# EAGLE design WalkieTalkie_Basic (EAGLE 7.3.0)
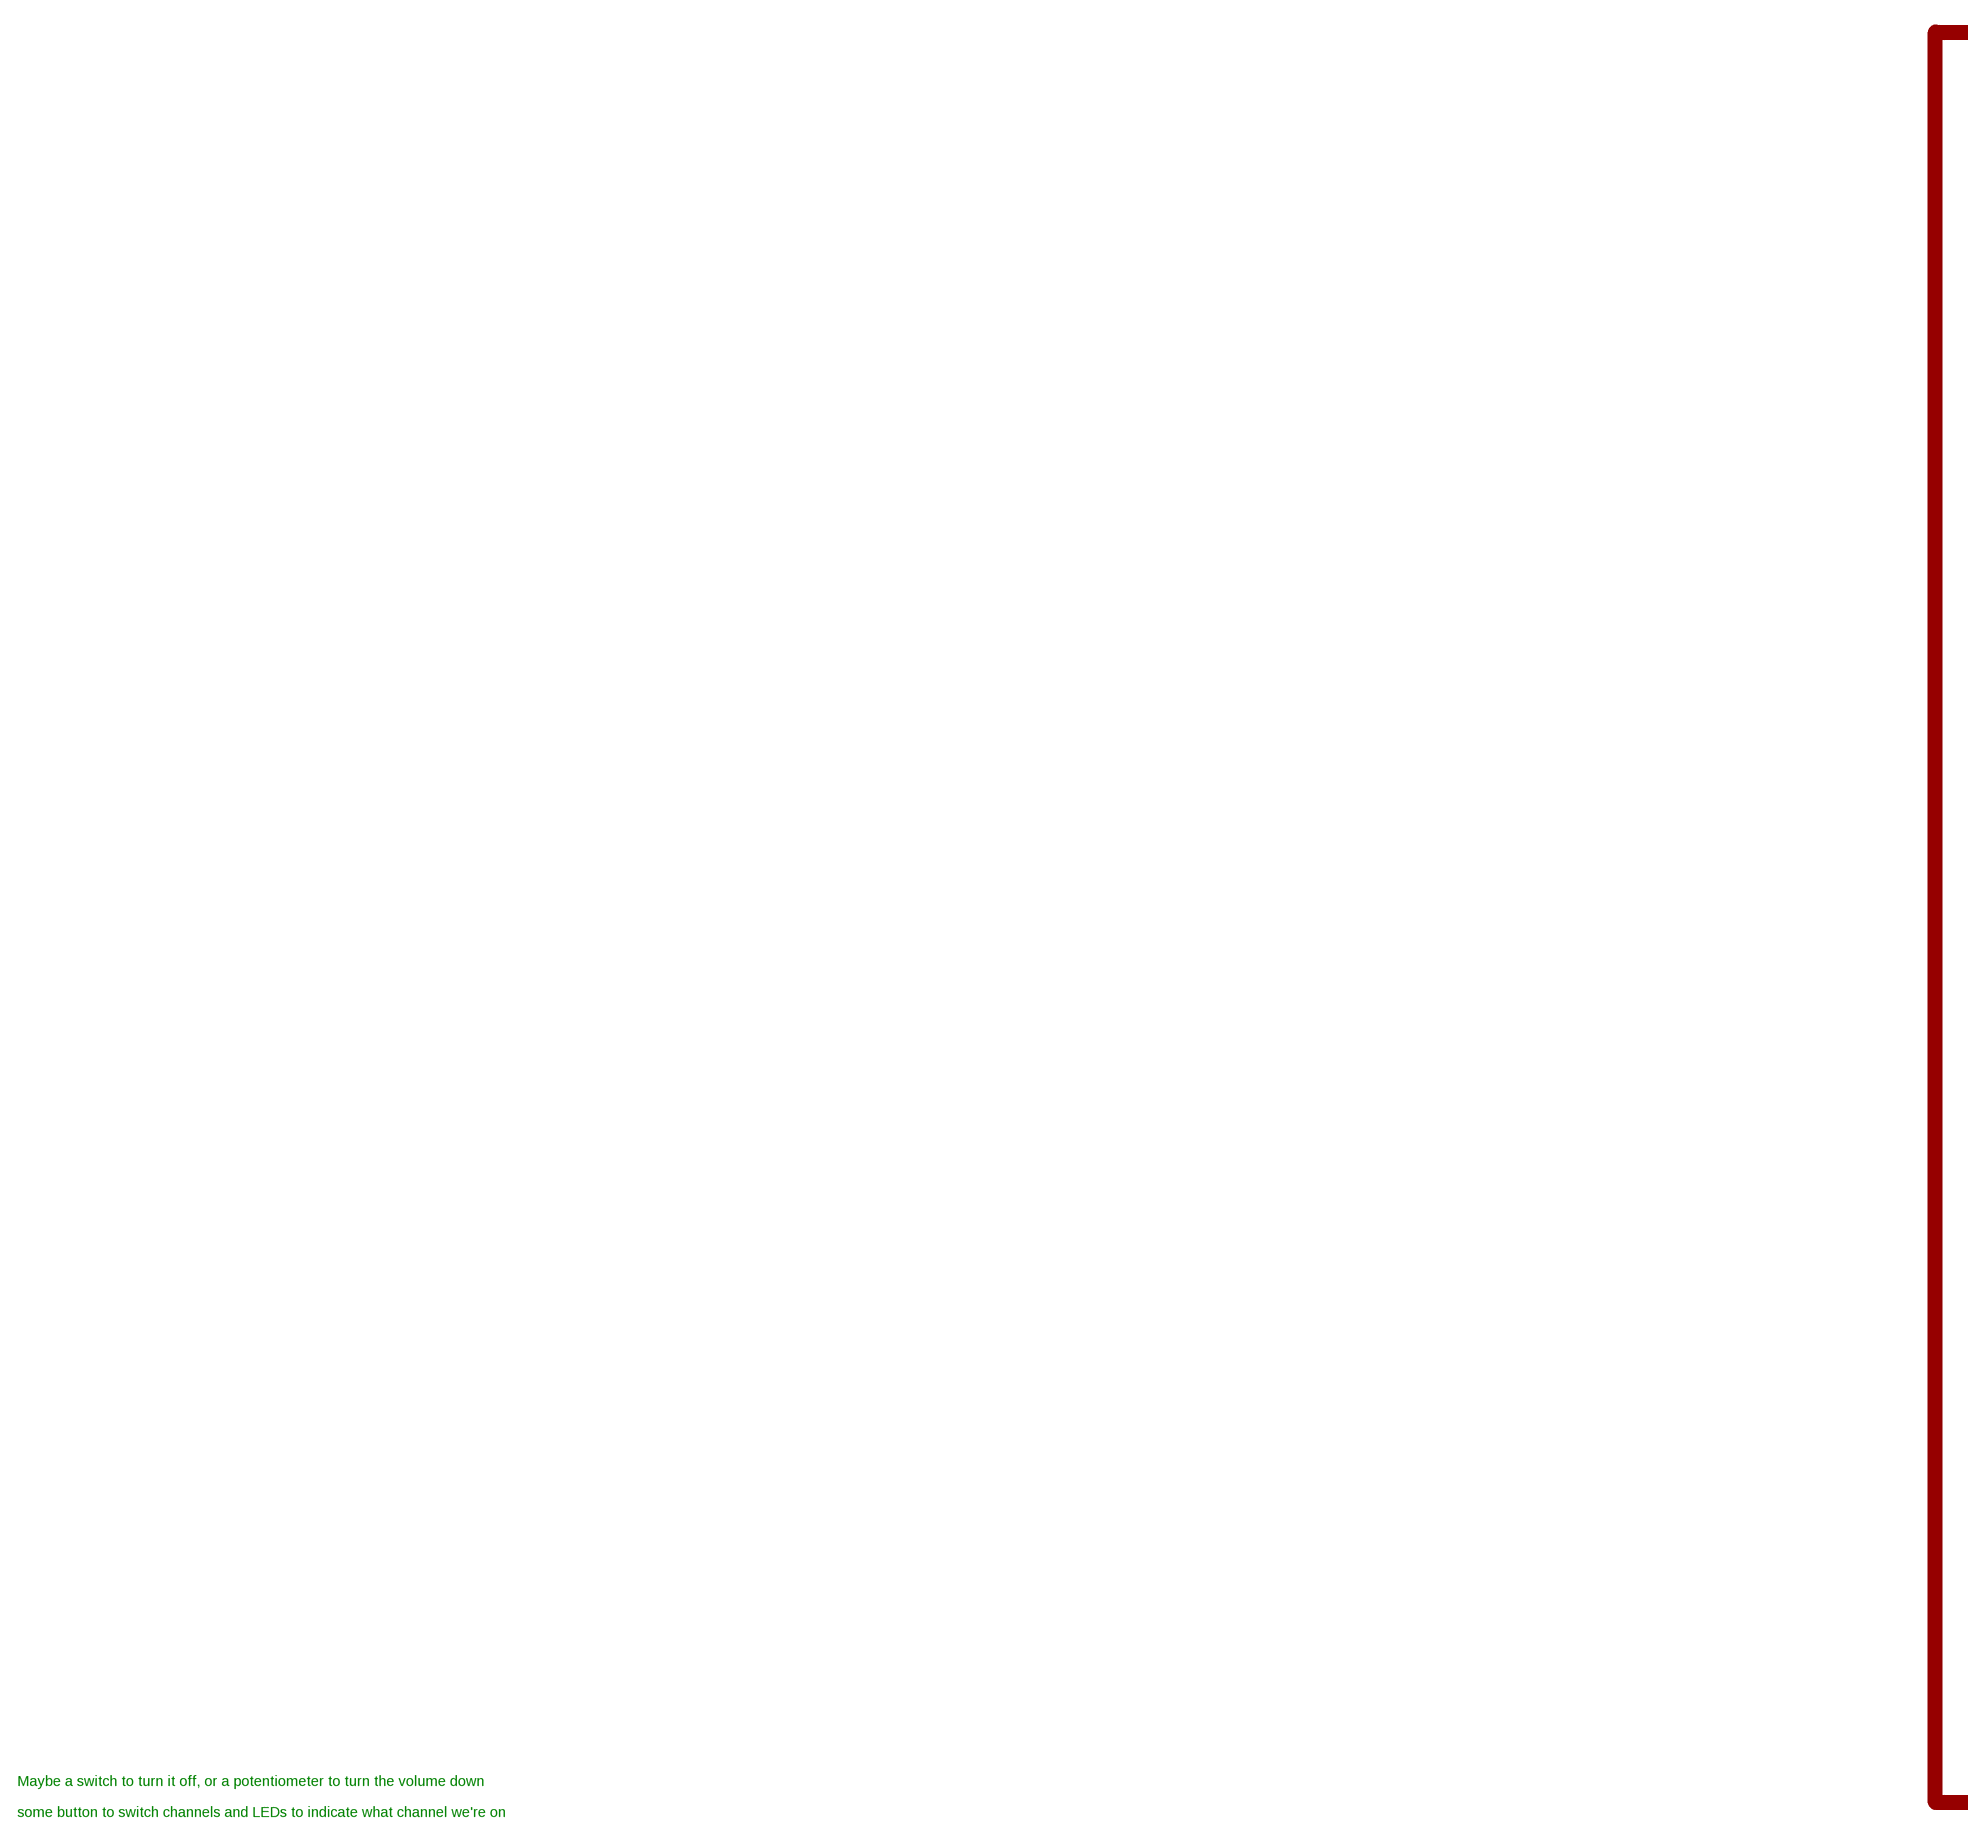
[diagram p0: schematic, sheet 1, part 1 of 2]
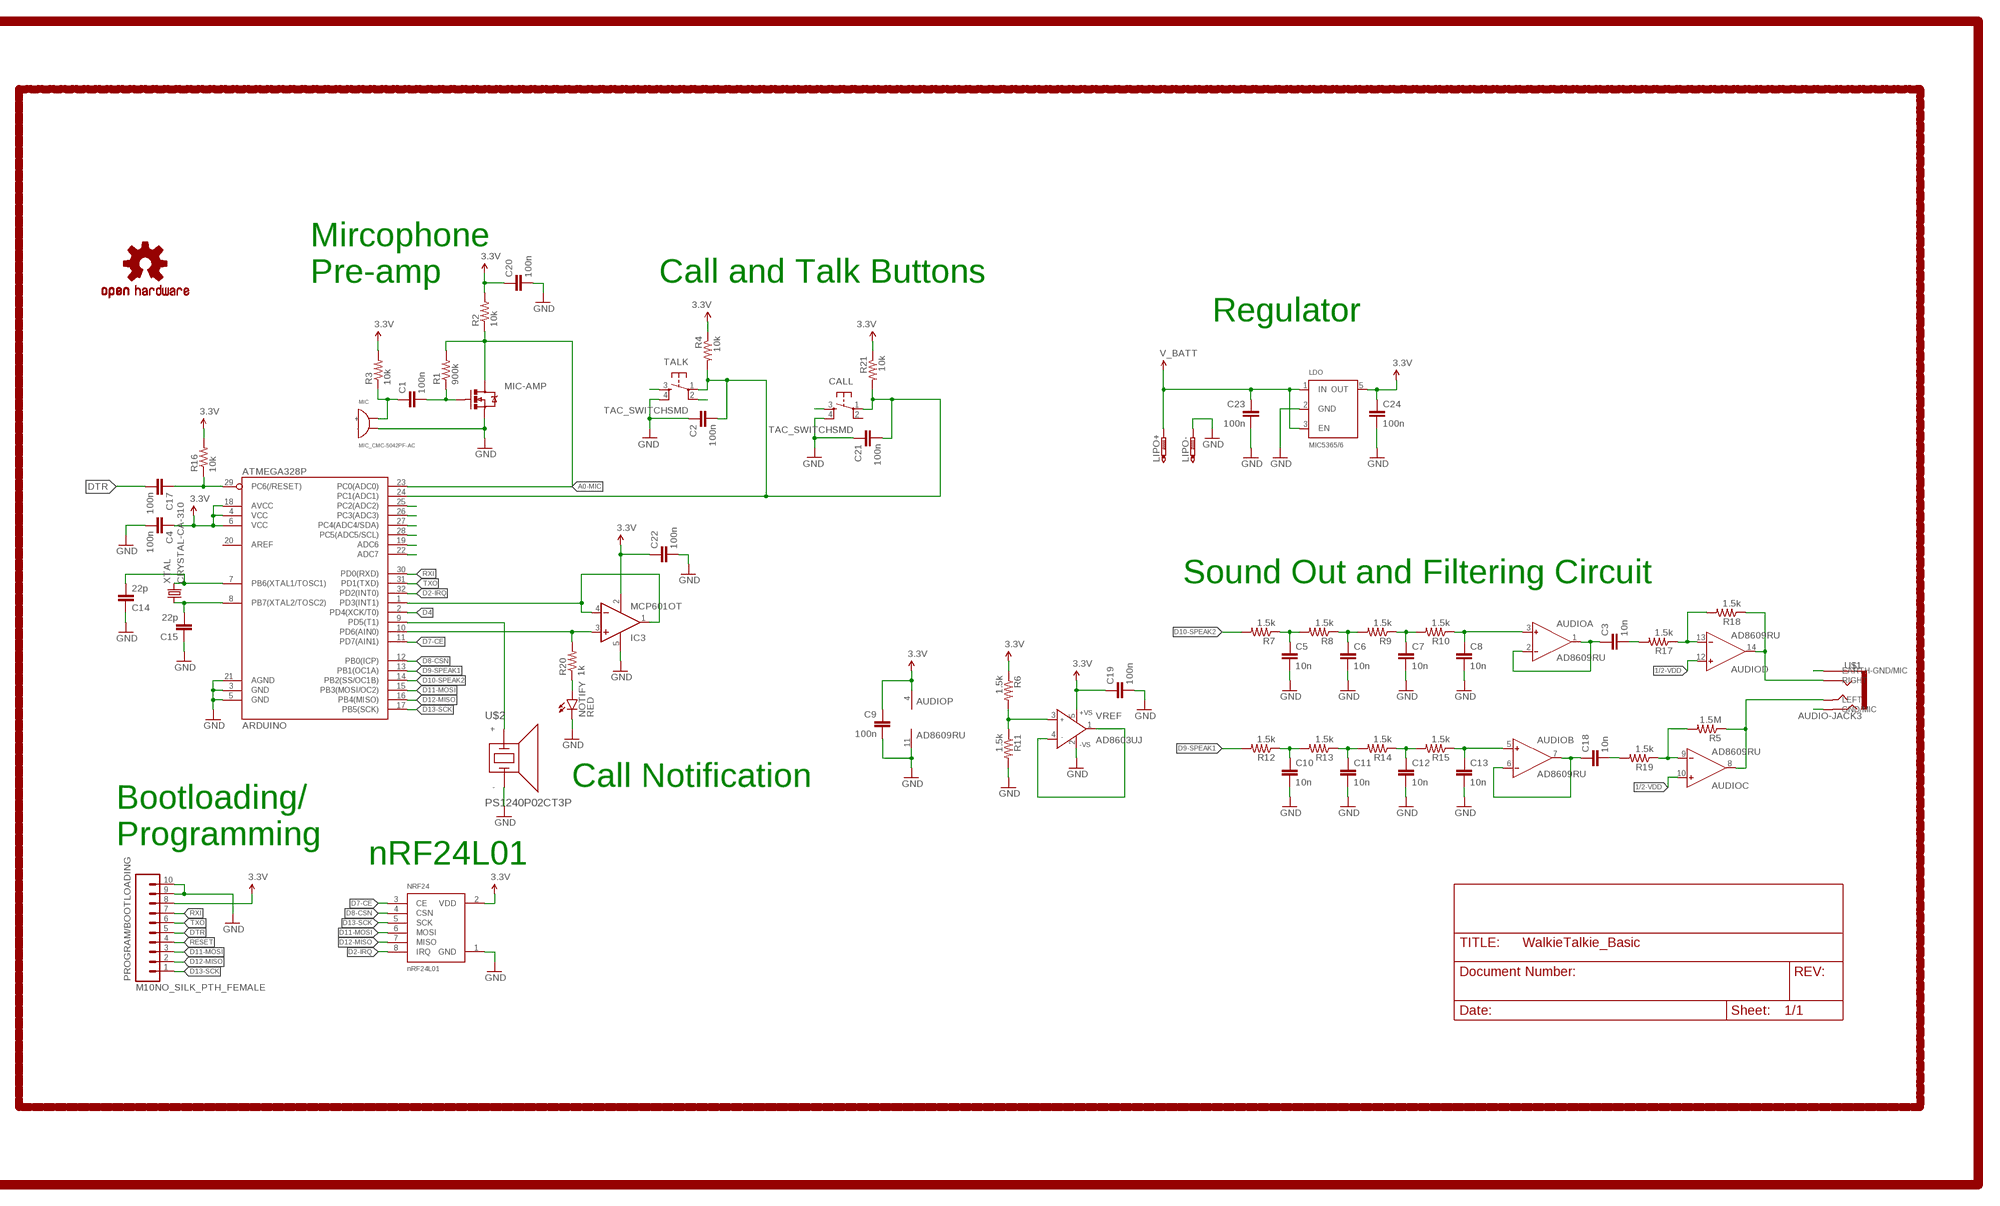
[diagram p1: schematic, sheet 1, part 2 of 2]

## Parts
ARDUINO  ATMEGA328P  ATMEGA328_SMT-OHMOD  [TQFP32-08]
AUDIO  AD8609RU  [TSSOP14]
C1  100n  C-EUC0402  [C0402]
C2  100n  C-EUC0402  [C0402]
C3  10n  C-EUC0402  [C0402]
C4  100n  C-EUC0402  [C0402]
C5  10n  C-EUC0402  [C0402]
C6  10n  C-EUC0402  [C0402]
C7  10n  C-EUC0402  [C0402]
C8  10n  C-EUC0402  [C0402]
C9  100n  C-EUC0402  [C0402]
C10  10n  C-EUC0402  [C0402]
C11  10n  C-EUC0402  [C0402]
C12  10n  C-EUC0402  [C0402]
C13  10n  C-EUC0402  [C0402]
C14  22p  C-EUC0402  [C0402]
C15  22p  C-EUC0402  [C0402]
C17  100n  C-EUC0402  [C0402]
C18  10n  C-EUC0402  [C0402]
C19  100n  C-EUC0402  [C0402]
C20  100n  C-EUC0402  [C0402]
C21  100n  C-EUC0402  [C0402]
C22  100n  C-EUC0402  [C0402]
C23  100n  C-EUC0402  [C0402]
C24  100n  C-EUC0402  [C0402]
CALL  TAC_SWITCHSMD  [TACTILE-SWITCH-SMD]
IC3  MCP601OT  [SOT23-5]
LDO  MIC5365/6  [SC-70-5]
LIPO  BATT-CONNECT  [HOLE]
LOGO1  OSHW-LOGOS  [OSHW-LOGO-S]
MIC  MIC_CMC-5042PF-AC  [MIC_01]
MIC-AMP  MOSFET-NCHANNELBSS123LT1G  [SOT23-3]
NOTIFY  RED  LED-RED0603  [LED-0603]
NRF24  NRF24L01-BREAKOUT  [NRF24L01-BREAKOUT]
PROGRAM/BOOTLOADING  M10NO_SILK_PTH_FEMALE  [1X10_NO_SILK]
R1  900k  R-US_R0402  [R0402]
R2  10k  R-US_R0402  [R0402]
R3  10k  R-US_R0402  [R0402]
R4  10k  R-US_R0402  [R0402]
R5  1.5M  R-US_R0402  [R0402]
R6  1.5k  R-US_R0402  [R0402]
R7  1.5k  R-US_R0402  [R0402]
R8  1.5k  R-US_R0402  [R0402]
R9  1.5k  R-US_R0402  [R0402]
R10  1.5k  R-US_R0402  [R0402]
R11  1.5k  R-US_R0402  [R0402]
R12  1.5k  R-US_R0402  [R0402]
R13  1.5k  R-US_R0402  [R0402]
R14  1.5k  R-US_R0402  [R0402]
R15  1.5k  R-US_R0402  [R0402]
R16  10k  R-US_R0402  [R0402]
R17  1.5k  R-US_R0402  [R0402]
R18  1.5k  R-US_R0402  [R0402]
R19  1.5k  R-US_R0402  [R0402]
R20  1k  R-US_R0402  [R0402]
R21  10k  R-US_R0402  [R0402]
TALK  TAC_SWITCHSMD  [TACTILE-SWITCH-SMD]
U$1  AUDIO-JACK3  [AUDIO-JACK-TRRS-SMD]
U$2  PS1240P02CT3P  [PIEZO-1]
VREF  AD8603UJ  [SOT23-5]
XTAL  CRYSTAL-CA-310  [CA-301]

## Nets
1/2-VDD: AUDIO.10(C:IN+) AUDIO.12(D:IN+) VREF.1(OUT) VREF.4(IN-)
3.3V: ARDUINO.4(VCC) ARDUINO.6(VCC) ARDUINO.18(AVCC) AUDIO.4(P:V+) C4.1 C9.1 C19.1 C20.1 C22.1 C24.1 IC3.2(V-) LDO.5(OUT) NRF24.2(VDD) PROGRAM/BOOTLOADING.8 R2.2 R3.2 R4.1 R6.1 R16.2 R21.1 VREF.5(+VS)
A0-MIC: ARDUINO.23(PC0(ADC0)) MIC-AMP.3(D) R1.2 R2.1
D2-IRQ: ARDUINO.32(PD2(INT0)) NRF24.8(IRQ)
D3: ARDUINO.1(PD3(INT1)) IC3.1(OUT) IC3.4(-IN)
D4: ARDUINO.2(PD4(XCK/T0))
D5: ARDUINO.9(PD5(T1)) U$2.+
D6: ARDUINO.10(PD6(AIN0)) IC3.3(+IN) R20.2
D7-CE: ARDUINO.11(PD7(AIN1)) NRF24.3(CE)
D8-CSN: ARDUINO.12(PB0(ICP)) NRF24.4(CSN)
D9-SPEAK1: ARDUINO.13(PB1(OC1A)) R12.2
D10-SPEAK2: ARDUINO.14(PB2(SS/OC1B)) R7.2
D11-MOSI: ARDUINO.15(PB3(MOSI/OC2)) NRF24.6(MOSI) PROGRAM/BOOTLOADING.3
D12-MISO: ARDUINO.16(PB4(MISO)) NRF24.7(MISO) PROGRAM/BOOTLOADING.2
D13-SCK: ARDUINO.17(PB5(SCK)) NRF24.5(SCK) PROGRAM/BOOTLOADING.1
DTR: C17.2 PROGRAM/BOOTLOADING.5
GND: ARDUINO.3(GND) ARDUINO.5(GND) ARDUINO.21(AGND) AUDIO.11(P:V-) C2.1 C4.2 C5.2 C6.2 C7.2 C8.2 C9.2 C10.2 C11.2 C12.2 C13.2 C14.1 C15.1 C19.2 C20.2 C21.1 C22.2 C23.2 C24.2 CALL.4 IC3.5(V+) LDO.2(GND) LIPO.P$2 MIC-AMP.2(S) MIC.- NOTIFY.C NRF24.1(GND) PROGRAM/BOOTLOADING.9 PROGRAM/BOOTLOADING.10 R11.2 TALK.4 U$2.- VREF.2(-VS)
N$1: TALK.2
N$2: TALK.3
N$3: AUDIO.14(D:OUT) R18.1 U$1.RING1(RIGHT)
N$4: AUDIO.8(C:OUT) R5.1 U$1.TIP(LEFT)
N$5: C1.2 MIC-AMP.1(G) R1.1
N$6: NOTIFY.A R20.1
N$7: AUDIO.1(A:OUT) AUDIO.2(A:IN-) C3.1
N$8: C1.1 MIC.+ R3.1
N$9: R6.2 R11.1 VREF.3(IN+)
N$10: C6.1 R8.1 R9.2
N$11: C7.1 R9.1 R10.2
N$12: U$1.RING2(GND/MIC)
N$13: AUDIO.3(A:IN+) C8.1 R10.1
N$14: C5.1 R7.1 R8.2
N$15: U$1.EARTH(EARTH-GND/MIC)
N$16: C11.1 R13.1 R14.2
N$17: C12.1 R14.1 R15.2
N$18: AUDIO.5(B:IN+) C13.1 R15.1
N$19: C10.1 R12.1 R13.2
N$20: ARDUINO.7(PB6(XTAL1/TOSC1)) C14.2 XTAL.2
N$21: ARDUINO.8(PB7(XTAL2/TOSC2)) C15.2 XTAL.1
N$22: ARDUINO.25(PC2(ADC2))
N$23: C3.2 R17.2
N$24: AUDIO.13(D:IN-) R17.1 R18.2
N$25: ARDUINO.26(PC3(ADC3))
N$26: AUDIO.6(B:IN-) AUDIO.7(B:OUT) C18.1
N$27: AUDIO.9(C:IN-) R5.2 R19.1
N$28: C18.2 R19.2
N$29: ARDUINO.27(PC4(ADC4/SDA))
N$30: ARDUINO.28(PC5(ADC5/SCL))
N$31: ARDUINO.19(ADC6)
N$32: ARDUINO.22(ADC7)
N$34: CALL.3
RESET: ARDUINO.29(PC6(/RESET)) C17.1 PROGRAM/BOOTLOADING.4 R16.1
RXI: ARDUINO.30(PD0(RXD)) PROGRAM/BOOTLOADING.7
TALK/CALL: ARDUINO.24(PC1(ADC1)) C2.2 C21.2 CALL.1 R4.2 R21.2 TALK.1
TXO: ARDUINO.31(PD1(TXD)) PROGRAM/BOOTLOADING.6
V_BATT: C23.1 LDO.1(IN) LDO.3(EN) LIPO.P$1
Unconnected: ARDUINO.20(AREF) CALL.2

## Notes on the sheet
- Mircophone
  Pre-amp
- Call and Talk Buttons
- Regulator
- Sound Out and Filtering Circuit
- Call Notification
- Bootloading/
  Programming
- nRF24L01
- Maybe a switch to turn it off, or a potentiometer to turn the volume down
  
  some button to switch channels and LEDs to indicate what channel we're on

## Library data of the parts
ARDUINO = SparkFun-DigitalIC:ATMEGA328_SMT-OHMOD: 32-Pin Atmega328 part Commonly used on Arduino compatible boards Available in QFP and QFN packages TQFP is IC-09069 QFN is non-stock; PROD_ID: IC-09069
AUDIO = analog-devices:AD8609: Precision Micropower, Low Noise CMOS, Rail-to-Rail Input/Output Operational Amplifiers Source: http://www.analog.com/static/imported-files/data_sheets/AD8603_8607_8609.pdf; MF: ALTERA CORPORATION; MPN: AD8609ARUZ; OC_FARNELL: 1464994; OC_NEWARK: 59K6934
C1-C15 C17-C24 = resistor:C-EU: CAPACITOR, European symbol
CALL TALK = SparkFun-Retired:TAC_SWITCH: Momentary Switch Button commonly used for reset or general input. Spark Fun Electronics SKU : COM-00097 SMT- SWCH-08247; PROD_ID: SWCH-08247
IC3 = linear:MCP601: Single Op Amp 2.7V to 6.0V Single Supply CMOS Source: http://ww1.microchip.com/downloads/en/DeviceDoc/21314g.pdf
LDO = Orlando:MIC5365/6
LIPO = OrlandoRonMod:BATT-CONNECT
LOGO1 = SparkFun-Aesthetics:OSHW-LOGO: Open Source Hardware Logo This logo indicates the piece of hardware it is found on incorporates a OSHW license and/or adheres to the definition of open source hardware found here: http://freedomdefined.org/OSHW
MIC = Orlando:MIC_CMC-5042PF-AC
MIC-AMP = SparkFun-DiscreteSemi:MOSFET-NCHANNEL: Common NMOSFET Parts MFG P/N Store ID Prod ID FDD8780 TRANS-09984 SI7820DN TRANS-11055 FDS6630A IC-08089 2N7002PW TRANS-11151 FQP30N06L COM-10213 TRANS-10060 BSS123LT1G TRANS-08345 BSS138 TRANS-00830 BS170 2N7000; PROD_ID: TRANS-08345
NOTIFY = SparkFun-LED:LED-RED: Assorted Red LEDs LilyPad 1206- DIO-09912 1206- DIO-00809 0603- DIO-00819; PROD_ID: DIO-00819
NRF24 = Orlando:NRF24L01-BREAKOUT
PROGRAM/BOOTLOADING = SparkFun-Connectors:M10: Header 10 Standard 10-pin 0.1" header. Use with straight break away headers (SKU : PRT-00116), right angle break away headers (PRT-00553), swiss pins (PRT-00743), machine pins (PRT-00117), and female headers (PRT-00115).; PROD_ID: CONN-11563
R1-R21 = resistor:R-US_: RESISTOR, American symbol
U$1 = SparkFun-Connectors:AUDIO-JACK3: Audio jack - 3.5mm TRRS variety - two rings.
U$2 = Orlando:PS1240P02CT3
VREF = analog-devices:AD8603: Precision Micropower, Low Noise CMOS, Rail-to-Rail Input/Output Operational Amplifiers Source: http://www.analog.com/static/imported-files/data_sheets/AD8603_8607_8609.pdf; MF: ALTERA CORPORATION; MPN: AD8603AUJZ-REEL7; OC_FARNELL: 1651290; OC_NEWARK: 59K6904
XTAL = OrlandoRonMod:CRYSTAL-CA-310

## Board
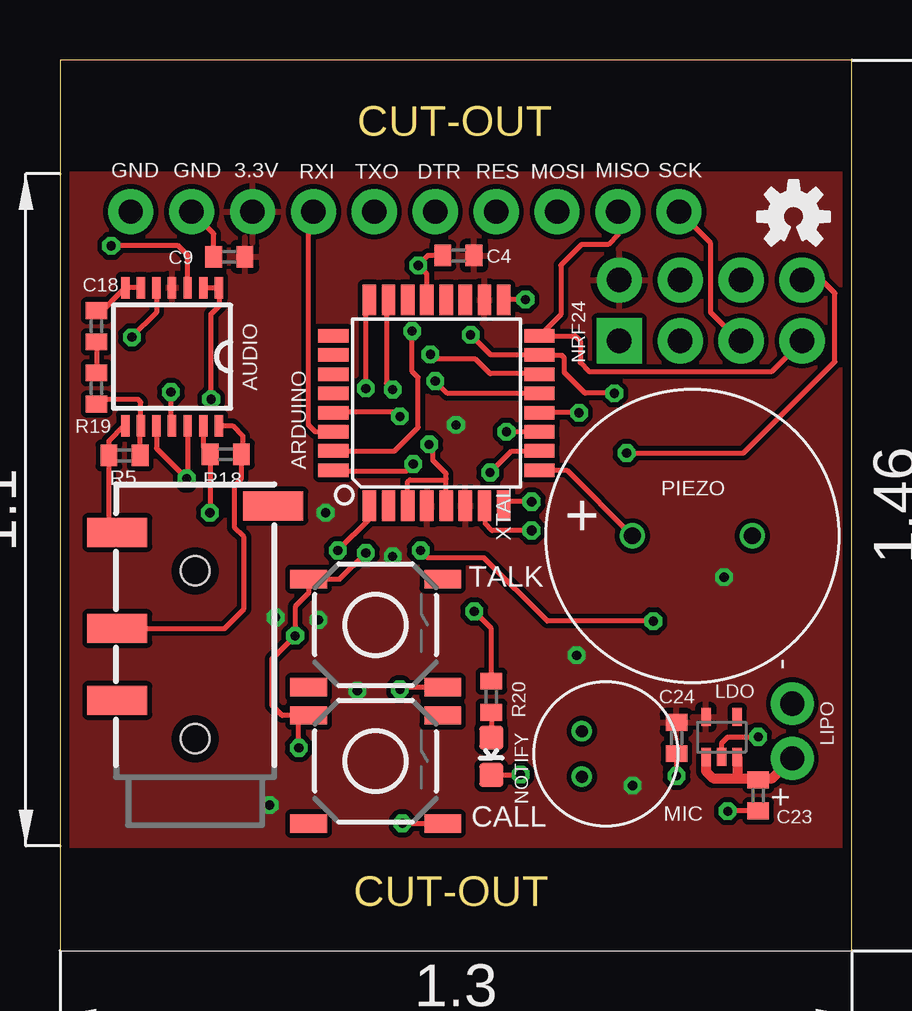
[diagram p2: board, top side]
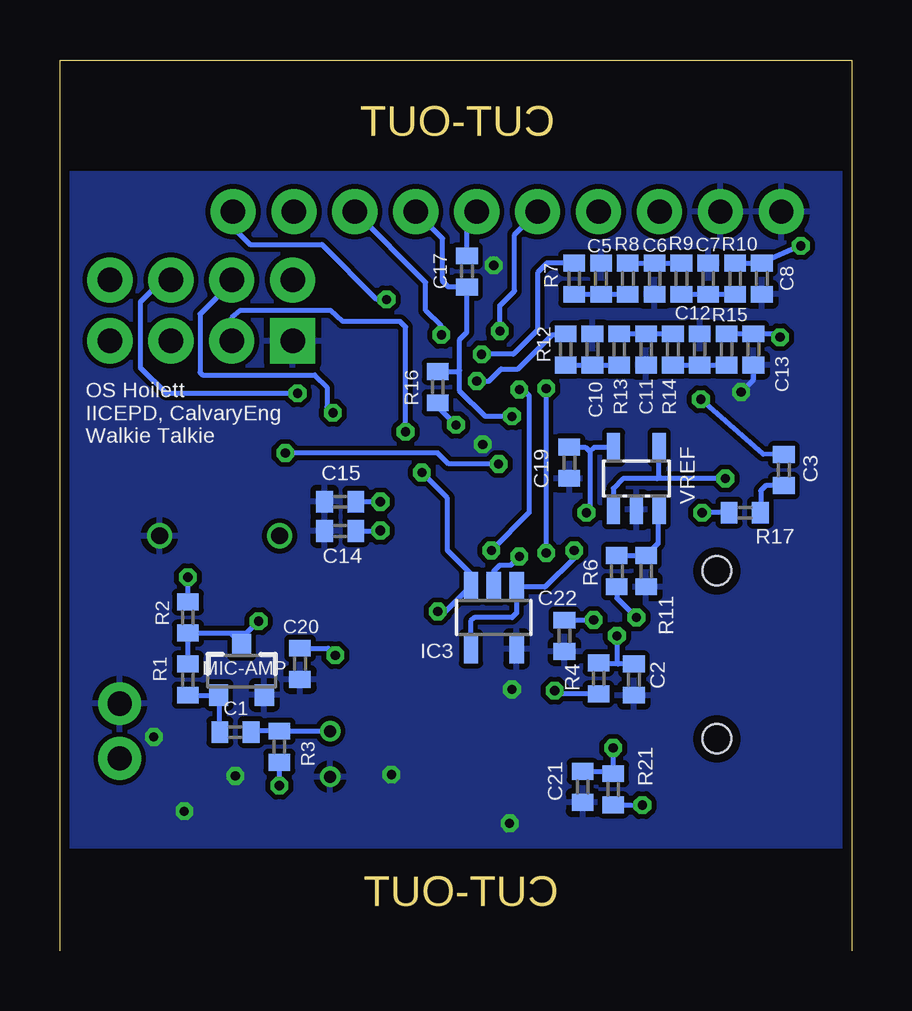
[diagram p3: board, bottom side, seen from below]

Size 33.02 x 37.13 mm. Coordinates in mm from the lower left corner, seen from the top.
Outline: 33.02,0 33.02,37.13 0,37.13 0,0
Copper layers (1*16): Top 0.0356mm / dielectric 1.5011mm / Bottom 0.0356mm
Design rules "LaenPCBOrder": minimum track width 6mil, minimum drill 13mil, track to track 6mil, track to pad 6mil, pad to pad 6mil, via to via 6mil, smd to smd 6mil, copper to edge 15mil, drill to drill 6mil, minimum pad ring 7mil, minimum via ring 7mil, stop-mask expansion 3mil, vias tented up to drill 0mil, thermal gap 10mil

### Footprints (pad centres in the part's own frame; a part is rotated, then mirrored left to right if it is on the bottom)
TQFP32-08 = smd 1.27 x 0.559: 1 -4.293,2.8; 2 -4.293,2; 3 -4.293,1.2; 4 -4.293,0.4; 5 -4.293,-0.4; 6 -4.293,-1.2; 7 -4.293,-2; 8 -4.293,-2.8; 17 4.293,-2.8; 18 4.293,-2; 19 4.293,-1.2; 20 4.293,-0.4; 21 4.293,0.4; 22 4.293,1.2; 23 4.293,2; 24 4.293,2.8 | smd 0.559 x 1.27: 9 -2.8,-4.293; 10 -2,-4.293; 11 -1.2,-4.293; 12 -0.4,-4.293; 13 0.4,-4.293; 14 1.2,-4.293; 15 2,-4.293; 16 2.8,-4.293; 25 2.8,4.293; 26 2,4.293; 27 1.2,4.293; 28 0.4,4.293; 29 -0.4,4.293; 30 -1.2,4.293; 31 -2,4.293; 32 -2.8,4.293
TSSOP14 = smd 0.9 x 0.35: 1 -2.875,1.95; 2 -2.875,1.3; 3 -2.875,0.65; 4 -2.875,0; 5 -2.875,-0.65; 6 -2.875,-1.3; 7 -2.875,-1.95; 8 2.875,-1.95; 9 2.875,-1.3; 10 2.875,-0.65; 11 2.875,0; 12 2.875,0.65; 13 2.875,1.3; 14 2.875,1.95
C0402 = smd 0.7 x 0.9: 1 -0.65,0; 2 0.65,0
TACTILE-SWITCH-SMD = smd 1.524 x 0.762: 1 -2.794,1.905; 2 2.794,1.905; 3 -2.794,-2.605; 4 2.794,-2.605
SOT23-5 = smd 0.6 x 1.2: 1 -0.95,-1.306; 2 0,-1.306; 3 0.95,-1.306; 4 0.95,1.306; 5 -0.95,1.306
SC-70-5 = smd 0.4 x 0.75: 1 -0.65,-0.825; 2 0,-0.825; 3 0.65,-0.825; 4 0.65,0.825; 5 -0.65,0.825
HOLE = drill 1.016 pad 1.778: P$1 -1.151,0; P$2 1.135,0
MIC_01 = drill 0.5: + -1,0.95; - -1,-0.95
SOT23-3 = smd 0.8 x 0.9: 1 -0.95,-1; 2 0.95,-1; 3 0,1.1
LED-0603 = smd 1 x 1: A 0,-0.677; C 0,0.877
NRF24L01-BREAKOUT = drill 1.016 pad 1.88 square: 1 -1.27,3.81 | drill 1.016 pad 1.88: 2 1.27,3.81; 3 -1.27,1.27; 4 1.27,1.27; 5 -1.27,-1.27; 6 1.27,-1.27; 7 -1.27,-3.81; 8 1.27,-3.81
1X10_NO_SILK = drill 1.016 pad 1.88: 1 0,0; 2 2.54,0; 3 5.08,0; 4 7.62,0; 5 10.16,0; 6 12.7,0; 7 15.24,0; 8 17.78,0; 9 20.32,0; 10 22.86,0
R0402 = smd 0.7 x 0.9: 1 -0.65,0; 2 0.65,0
AUDIO-JACK-TRRS-SMD = smd 1.2 x 2.5: EARTH 11.3,-3.25; RING1 6.2,3.25; RING2 3.2,3.25; TIP 10.2,3.25 | hole 1.2: 1.6,0; 8.6,0
PIEZO-1 = drill 0.7: + -2.5,0; - 2.5,0
SOT23-5' = smd 0.55 x 1.2: 1 -0.95,-1.3; 2 0,-1.3; 3 0.95,-1.3; 4 0.95,1.3; 5 -0.95,1.3
CA-301 = drill 0.4 octagon: 1 0,0; 2 1.2,0

### Placement (x,y rotation side)
ARDUINO  15.7,22.83 90 top
AUDIO  4.67,24.77 270 top
C1  25.7,9.12 180 bottom
C2  9.09,11.3 90 bottom
C3  2.84,20.04 270 bottom
C4  16.61,28.98 180 top
C5  10.46,28.02 90 bottom
C6  8.23,28.02 270 bottom
C7  5.99,28.02 90 bottom
C8  3.76,28.02 270 bottom
C9  7.06,28.93 180 top
C10  10.82,25.07 90 bottom
C11  8.59,25.07 270 bottom
C12  6.35,25.07 90 bottom
C13  4.11,25.07 270 bottom
C14  21.34,17.5 0 bottom
C15  21.34,18.72 0 bottom
C17  16.05,28.32 90 bottom
C18  1.52,26.03 270 top
C19  11.79,20.35 270 bottom
C20  23.01,11.96 270 bottom
C21  11.23,6.83 90 bottom
C22  11.99,13.13 270 bottom
C23  29.11,6.48 270 top
C24  25.7,8.86 270 top
CALL  13.16,7.9 0 top
IC3  14.94,13.89 180 bottom
LDO  27.58,8.92 0 top
LIPO  30.53,9.17 90 top
LOGO1  30.58,30.61 0 top
MIC  22.76,8.2 0 top
MIC-AMP  25.45,11.66 0 bottom
NOTIFY  17.98,8.2 180 top
NRF24  27.13,26.7 90 top
PROGRAM/BOOTLOADING  25.81,30.81 180 top
R1  27.69,11.3 90 bottom
R2  27.69,13.89 90 bottom
R3  23.88,8.51 270 bottom
R4  10.57,11.35 90 bottom
R5  2.69,20.65 0 top
R6  9.8,15.82 90 bottom
R7  11.58,28.02 90 bottom
R8  9.35,28.02 270 bottom
R9  7.11,28.02 90 bottom
R10  4.88,28.02 270 bottom
R11  8.59,15.82 270 bottom
R12  11.94,25.07 90 bottom
R13  9.7,25.07 270 bottom
R14  7.47,25.07 90 bottom
R15  5.23,25.07 270 bottom
R16  17.27,23.5 270 bottom
R17  4.47,18.26 0 bottom
R18  6.91,20.7 180 top
R19  1.52,23.44 90 top
R20  17.98,10.59 90 top
R21  9.96,6.73 90 bottom
TALK  13.16,13.59 0 top
U$1  5.64,7.24 90 top
U$2  26.37,17.3 0 top
VREF  AD8603UJ  [SOT23-5']  8.99,19.68 0 bottom
XTAL  19.66,18.72 270 top

### Tracks (layer width: path | path; a pad name or v marks a point on that pad's centre or on a via)
1/2-VDD  (via drill 0.38)
  Top 0.203: 5.33,21.88 AUDIO.12 | 5.33,21.9 AUDIO.12 | AUDIO.10 4.02,20.94 v5.28,19.68 5.32,19.73 AUDIO.12
  Bottom 0.203: 8.13,19.68 9.55,19.68 9.96,19.28 9.96,18.4 VREF.1 | v5.28,19.68 8.13,19.68 | VREF.4 8.04,19.77 8.13,19.68
3.3V  (via drill 0.38)
  Bottom 0.203: R3.2 v23.88,6.88 | R2.2 v27.69,15.57 | C20.1 21.83,12.61 v21.54,12.32 | R21.1 9.23,6.08 v8.74,6.07 | VREF.5 10.74,20.98 10.92,20.8 | 10.92,20.8 10.92,18.52 v11.07,18.26 | C19.1 11.12,21 10.92,20.8 | C22.1 10.78,13.78 v10.77,13.79 | R4.1 12.25,10.7 v12.39,10.85 | R16.2 17.27,22.68 v16.51,21.92 | IC3.2 14.94,15.82 14.68,16.08 14.22,16.08 v13.87,16.43 | R6.1 9.8,14.71 v8.99,13.89
  pour Top (isolate 0.203): 0,32.38 33.02,32.38 33.02,4.37 0,4.37
A0-MIC  (via drill 0.38)
  Top 0.203: v24.74,13.74 20.32,13.74 17.68,16.38 15.34,16.38 v15.04,16.69 | ARDUINO.23 13.61,27.04 13.61,23.65 v13.87,23.39
  Bottom 0.203: R1.2 R2.1 25.94,13.24 | 25.94,13.24 MIC-AMP.3 | 25.94,13.24 25.24,13.24 v24.74,13.74 | v13.87,23.39 13.72,23.39 13.46,23.14 13.46,18.26 v15.04,16.69
D2-IRQ  (via drill 0.38)
  Top 0.203: ARDUINO.32 11.45,19.99 14.43,19.99 v14.73,20.29 | v23.62,20.75 28.5,20.75 32.31,24.56 32.31,27.41 31.75,27.97 NRF24.8
  Bottom 0.203: v14.73,20.29 16.82,20.29 17.27,20.75 v23.62,20.75
D3  (via drill 0.38)
  Top 0.203: ARDUINO.1 12.9,18 v11.58,16.69
  Bottom 0.203: IC3.4 15.9,12.6 15.9,13.74 15.75,13.89 14.17,13.89 13.98,14.08 IC3.1 13.95,15.16 12.8,15.16 11.58,16.38 v11.58,16.69
D5
  Top 0.203: ARDUINO.9 21.13,20.03 U$2.+
D6  (via drill 0.38)
  Top 0.203: R20.2 17.98,13.44 v17.27,14.15 | ARDUINO.10 19.96,20.8 18.8,20.8 v17.93,19.94
  Bottom 0.203: v17.27,14.15 16.94,14.15 IC3.3 15.88,15.71 16.87,16.69 16.87,18.87 v17.93,19.94
D7-CE  (via drill 0.38)
  Top 0.203: ARDUINO.11 v18.61,21.63
  Bottom 0.203: v18.61,21.63 18.61,26 18.85,26.24 21.23,26.24 21.74,26.7 25.5,26.7 25.86,26.39 NRF24.3
D8-CSN  (via drill 0.38)
  Top 0.203: v21.64,22.43 ARDUINO.12
  Bottom 0.203: NRF24.4 25.86,27.86 27.18,26.54 27.18,24.1 27.08,24 22.4,24 21.89,23.49 21.89,22.68 v21.64,22.43
D9-SPEAK1  (via drill 0.38)
  Top 0.203: ARDUINO.13 16.16,23.23 v15.65,23.75
  Bottom 0.203: R12.2 11.98,25.68 12.5,25.68 13.92,24.26 14.63,24.26 15.14,23.75 v15.65,23.75
D10-SPEAK2  (via drill 0.38)
  Top 0.203: ARDUINO.14 19.97,24.05 17.93,24.05 17.32,24.66 15.65,24.66 v15.44,24.87
  Bottom 0.203: R7.2 12.71,28.67 13.11,28.27 13.11,25.88 14.12,24.87 v15.44,24.87
D11-MOSI  (via drill 0.38)
  Top 0.203: 20.02,24.87 ARDUINO.15 | ARDUINO.15 17.96,24.83 v17.12,25.68 | ARDUINO.15 20.01,24.82 20.93,24.82 21.03,24.71 21.03,24.1 21.57,23.57 21.74,23.39 21.89,23.24 v23.11,23.24
  Bottom 0.203: NRF24.6 28.75,27.97 29.67,27.05 29.67,24.31 28.6,23.24 v23.11,23.24 | v17.12,25.68 17.12,26.03 17.78,26.7 17.78,27.86 PROGRAM/BOOTLOADING.3
D12-MISO
  Top 0.203: PROGRAM/BOOTLOADING.2 23.27,29.84 22.86,29.44 21.74,29.44 20.88,28.57 20.88,26.52 ARDUINO.16 21.49,25.63 21.69,25.43 21.69,24.51 22.05,24.16 29.67,24.16 NRF24.7
D13-SCK  (via drill 0.38)
  Top 0.203: v19.41,27.15 18.52,27.15 ARDUINO.17 | NRF24.5 28.3,25.43 27.13,26.59 27.13,29.49 PROGRAM/BOOTLOADING.1
  Bottom 0.203: PROGRAM/BOOTLOADING.1 25.81,30.15 25.09,29.44 22.1,29.44 19.81,27.15 v19.41,27.15
DTR
  Bottom 0.203: C17.2 16.05,30.4 PROGRAM/BOOTLOADING.5
GND  (via drill 0.38)
  Top 0.203: v4.62,23.29 4.62,21.94 AUDIO.11 | C9.2 6.41,29.89 PROGRAM/BOOTLOADING.9 | ARDUINO.5 16.1,19.68 | 16.1,19.68 16.1,19.89 15.54,20.45 15.54,20.95 v15.39,21.11 | ARDUINO.3 14.5,19.55 14.58,19.63 16.05,19.63 16.1,19.68 | LDO.2 27.58,8.66 27.84,8.92 v29.11,8.92 | C23.2 27.85,5.83 v27.84,5.82 | C24.2 v25.7,7.29 | ARDUINO.21 15.3,28.21 v14.94,28.57 15.34,28.98 C4.2 | TALK.4 14.26,10.98 v14.17,10.9 | NOTIFY.C 19.29,7.33 v19.2,7.34 | CALL.4 14.29,5.3 v14.28,5.31
  Bottom 0.203: C13.2 4.12,23.8 v4.62,23.29
  pour Bottom (isolate 0.203): 0,32.38 33.02,32.38 33.02,4.37 0,4.37
N$3
  Top 0.203: AUDIO.14 7.19,21.89 7.62,21.46 7.62,20.76 R18.1 7.56,19.67 7.26,19.38 7.26,17.65 7.67,17.25 7.67,14.25 6.86,13.44 U$1.RING1
N$4
  Top 0.203: AUDIO.8 2.66,21.89 2.03,21.26 2.03,20.66 | 2.03,20.66 R5.1 | 2.03,20.66 2.03,17.8 U$1.TIP
N$5
  Bottom 0.203: C1.2 26.36,10.61 MIC-AMP.1 R1.1
N$6
  Top 0.203: R20.1 NOTIFY.A
N$7  (via drill 0.38)
  Top 0.203: AUDIO.2 AUDIO.1 6.66,27.61 6.66,26.9 6.3,26.54 v6.3,22.99
  Bottom 0.203: C3.1 3.71,20.7 v6.3,22.99
N$8
  Bottom 0.203: MIC.+ R3.1 25.01,9.16 C1.1
N$9
  Bottom 0.203: VREF.3 8.09,18.34 8.09,16.97 R11.1 R6.2
N$10
  Bottom 0.203: R8.1 C6.1 R9.2
N$11
  Bottom 0.203: R9.1 C7.1 R10.2
N$13  (via drill 0.38)
  Top 0.203: AUDIO.3 5.32,28.99 4.93,29.39 v2.13,29.39
  Bottom 0.203: v2.13,29.39 3.75,28.68 C8.1 R10.1
N$14
  Bottom 0.203: R7.1 C5.1 R8.2
N$16
  Bottom 0.203: R13.1 C11.1 R14.2
N$17
  Bottom 0.203: R14.1 C12.1 R15.2
N$18  (via drill 0.38)
  Top 0.203: AUDIO.5 4.02,26.6 v3,25.58
  Bottom 0.203: R15.1 C13.1 3.14,25.72 v3,25.58
N$19
  Bottom 0.203: R12.1 C10.1 R13.2
N$20
  Top 0.203: ARDUINO.7 17.73,18.51 17.73,17.81 18.02,17.52 XTAL.2 19.68,17.5
  Bottom 0.203: C14.2 19.68,17.5 XTAL.2
N$21
  Top 0.203: XTAL.1 18.68,18.72 ARDUINO.8
  Bottom 0.203: C15.2 XTAL.1
N$23
  Bottom 0.203: C3.2 3.6,19.39 3.81,19.18 R17.2
N$24  (via drill 0.38)
  Top 0.203: AUDIO.13 5.97,20.99 R18.2 v6.26,18.27 v6.25,18.26
  Bottom 0.203: R17.1 v6.25,18.26
N$26
  Top 0.203: AUDIO.6 AUDIO.7 1.52,26.44 C18.1
N$27
  Top 0.203: R19.1 1.82,22.99 3.25,22.99 3.37,22.86 AUDIO.9 3.34,21.86 R5.2
N$28
  Top 0.203: C18.2 R19.2
RESET  (via drill 0.38)
  Top 0.203: ARDUINO.29 11.45,22.48 13.97,22.48 v14.17,22.28
  Bottom 0.203: PROGRAM/BOOTLOADING.4 17.07,29.69 17.07,27.91 16.82,27.67 C17.1 16.05,25.78 16.36,25.48 16.36,24.21 | v14.17,22.28 15.29,22.28 16.36,23.34 16.36,24.21 | R16.1 16.42,24.14 16.36,24.21
RXI
  Top 0.203: ARDUINO.30 10.65,21.63 10.36,21.92 10.36,30.61 PROGRAM/BOOTLOADING.7
TALK/CALL  (via drill 0.38)
  Top 0.203: v12.75,23.44 12.75,26.98 ARDUINO.24 | v12.75,16.59 11.66,15.49 TALK.1 10.36,14.91 9.8,14.35 v9.8,13.13 8.84,12.17 8.84,10.24 9.27,9.81 CALL.1 9.96,9.6 v9.96,8.46
  Bottom 0.203: v12.75,23.44 v12.75,16.59 | v9.8,13.13 9.8,12.01 | 9.8,12.01 9.86,11.96 10.53,11.96 R4.2 | C2.2 9.74,11.95 9.8,12.01 | C21.2 10.06,7.48 R21.2 v9.96,8.46
TXO  (via drill 0.38)
  Top 0.203: ARDUINO.31 13.95,20.83 14.94,21.82 14.94,23.9 14.68,24.16 v14.68,25.83
  Bottom 0.203: v14.68,25.83 14.68,26.9 14.07,27.51 14.07,29.84 PROGRAM/BOOTLOADING.6
V_BATT
  Top 0.203: 28.29,8.03 LDO.3
  Top 0.406: LDO.1 26.93,7.48 27.23,7.19 28.3,7.19 | 28.3,7.19 29.05,7.19 | 29.05,7.19 C23.1 | 29.05,7.19 29.7,7.19 LIPO.P$1 | LDO.3 28.23,7.25 28.3,7.19

### Text on the board
Dimension: CUT-OUT | CUT-OUT
tPlace: Dimensions are in inches (in)
tNames: GND | GND | 3.3V | RXI | TXO | DTR | RES | MOSI | MISO | SCK | PIEZO | XTAL
bNames: OS Hoilett / IICEPD, CalvaryEng / Walkie Talkie